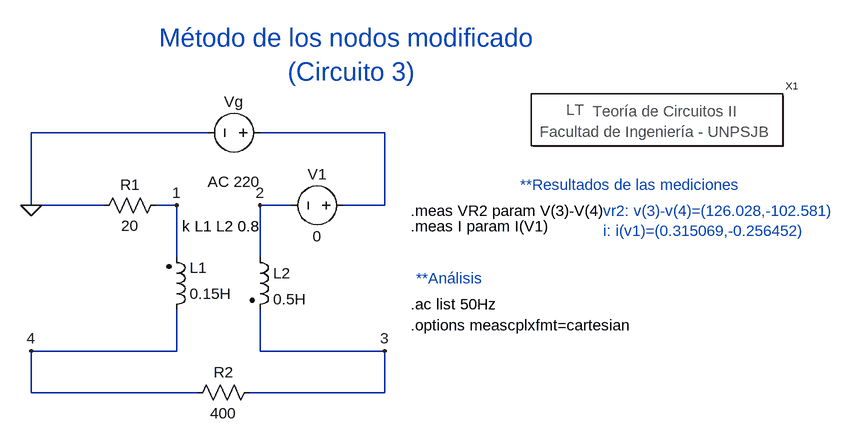
[diagram p0: schematic nodos_modificado3.asc]
nodos_modificado3.asc, the LTspice schematic file:
Version 4
SHEET 1 944 680
WIRE -48 48 -320 48
WIRE 224 48 32 48
WIRE -320 160 -320 48
WIRE -208 160 -320 160
WIRE -96 160 -128 160
WIRE 80 160 32 160
WIRE 224 160 224 48
WIRE 224 160 160 160
WIRE -96 240 -96 160
WIRE 32 240 32 160
WIRE -96 384 -96 320
WIRE -96 384 -320 384
WIRE 32 384 32 320
WIRE 224 384 32 384
WIRE -320 448 -320 384
WIRE -64 448 -320 448
WIRE 224 448 224 384
WIRE 224 448 16 448
FLAG -96 160 1
FLAG 32 160 2
FLAG 224 384 3
FLAG -320 384 4
FLAG -320 160 0
SYMBOL res -112 144 R90
WINDOW 0 0 56 VBottom 2
WINDOW 3 32 56 VTop 2
SYMATTR InstName R1
SYMATTR Value 20
SYMBOL ind2 -112 336 M180
WINDOW 0 36 80 Left 2
WINDOW 3 36 40 Left 2
SYMATTR InstName L1
SYMATTR Value 0.15H
SYMATTR Type ind
SYMBOL ind2 16 224 R0
SYMATTR InstName L2
SYMATTR Value 0.5H
SYMATTR Type ind
SYMBOL voltage 176 160 R90
WINDOW 0 -32 56 VBottom 2
WINDOW 3 32 56 VTop 2
SYMATTR InstName V1
SYMATTR Value 0
SYMBOL Circuitos2\\Letreros\\Teoría\ de\ Circuitos\ II 640 32 R0
SYMATTR InstName X1
SYMBOL voltage 48 48 R90
WINDOW 0 -32 56 VBottom 2
WINDOW 3 32 56 VTop 2
WINDOW 123 60 56 VTop 2
WINDOW 39 0 0 Left 0
SYMATTR InstName Vg
SYMATTR Value ""
SYMATTR Value2 AC 220
SYMBOL res 32 432 R90
WINDOW 0 0 56 VBottom 2
WINDOW 3 32 56 VTop 2
SYMATTR InstName R2
SYMATTR Value 400
TEXT 272 272 Left 2 ;**Análisis
TEXT 264 312 Left 2 !.ac list 50Hz
TEXT 264 344 Left 2 !.options meascplxfmt=cartesian
TEXT 168 -72 Center 4 ;Método de los nodos modificado\n (Circuito 3)
TEXT 432 128 Left 2 ;**Resultados de las mediciones
TEXT 264 168 Left 2 !.meas VR2 param V(3)-V(4)
TEXT -88 192 Left 2 !k L1 L2 0.8
TEXT 264 192 Left 2 !.meas I param I(V1)
TEXT 560 168 Left 2 ;vr2: v(3)-v(4)=(126.028,-102.581)\ni: i(v1)=(0.315069,-0.256452)

The netlist it stands for:
* nodos_modificado3.asc
R1 1 0 20
L1 4 1 0.15H
L2 2 3 0.5H
V1 N001 2 0
XX1 Teoría de Circuitos II
Vg N001 0 AC 220
R2 3 4 400
* **Análisis
.ac list 50Hz
.options meascplxfmt=cartesian
* Método de los nodos modificado
*  (Circuito 3)
* **Resultados de las mediciones
.meas VR2 param V(3)-V(4)
k L1 L2 0.8
.meas I param I(V1)
* vr2: v(3)-v(4)=(126.028,-102.581)
* i: i(v1)=(0.315069,-0.256452)
.backanno
.end